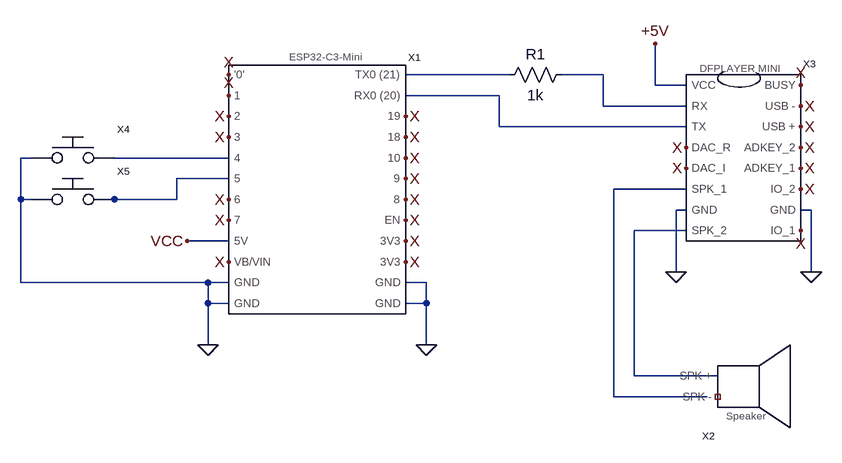
[diagram p0: schematic MP3_Player.asc]
MP3_Player.asc, the LTspice schematic file:
Version 4.1
SHEET 1 880 680
WIRE 176 0 16 0
WIRE 320 0 256 0
WIRE 400 16 400 -48
WIRE 448 16 400 16
WIRE 160 32 16 32
WIRE 320 48 320 0
WIRE 448 48 320 48
WIRE 160 80 160 32
WIRE 448 80 160 80
WIRE -560 128 -576 128
WIRE -256 128 -432 128
WIRE -256 160 -336 160
WIRE 448 176 336 176
WIRE -576 192 -576 128
WIRE -560 192 -576 192
WIRE -432 192 -448 192
WIRE -336 192 -336 160
WIRE -336 192 -432 192
WIRE 448 208 432 208
WIRE 640 208 624 208
WIRE 448 240 368 240
WIRE -256 256 -320 256
WIRE 432 304 432 208
WIRE 640 304 640 208
WIRE -576 320 -576 192
WIRE -288 320 -576 320
WIRE -256 320 -288 320
WIRE 48 320 16 320
WIRE -288 352 -288 320
WIRE -256 352 -288 352
WIRE 48 352 48 320
WIRE 48 352 16 352
WIRE -288 416 -288 352
WIRE 48 416 48 352
WIRE 368 464 368 240
WIRE 496 464 368 464
WIRE 336 496 336 176
WIRE 480 496 336 496
FLAG 400 -48 +5V
FLAG -320 256 VCC
FLAG -256 224 X
FLAG -256 288 X
FLAG 16 288 X
FLAG 16 256 X
FLAG 16 224 X
FLAG 16 192 X
FLAG 16 160 X
FLAG 16 128 X
FLAG 16 96 X
FLAG 16 64 X
FLAG -256 96 X
FLAG -256 64 X
FLAG -256 32 X
FLAG -256 0 X
FLAG 624 16 X
FLAG 624 48 X
FLAG 624 80 X
FLAG 624 112 X
FLAG 624 144 X
FLAG 624 176 X
FLAG 624 240 X
FLAG 448 144 X
FLAG 448 112 X
FLAG 48 416 0
FLAG -288 416 0
FLAG 432 304 0
FLAG 640 304 0
FLAG -256 192 X
SYMBOL symbols\\ESP32-C3-Mini -208 64 R0
SYMATTR InstName X1
SYMBOL symbols\\Speaker 448 464 R180
SYMATTR InstName X2
SYMBOL symbols\\DFPlayer_Mini 480 32 R0
SYMATTR InstName X3
SYMBOL res 160 16 R270
WINDOW 0 32 56 VTop 2
WINDOW 3 0 56 VBottom 2
SYMATTR InstName R1
SYMATTR Value 1k
SYMBOL symbols\\Push_Button -496 128 R0
SYMATTR InstName X4
SYMBOL symbols\\Push_Button -496 192 R0
SYMATTR InstName X5

The netlist it stands for:
* MP3_Player.asc
X§X1 X X X X N004 N005 X X VCC X 0 0 N001 N003 X X X X X X X X 0 0 ESP32-C3-Mini  ; pins '0' 1 2 3 4 5 6 7 5V VB/VIN GND GND TX0_(21) RX0_(20) 19 18 10 9 8 EN 3V3 3V3 GND GND
X§X2 NC_01 N007 Speaker  ; pins SPK_- SPK_+
X§X3 +5V N002 N003 X X N006 0 N007 X X X X X X 0 X DFPlayer_Mini  ; pins VCC RX TX DAC_R DAC_I SPK_1 GND SPK_2 BUSY USB_- USB_+ ADKEY_2 ADKEY_1 IO_2 GND IO_1
R1 N001 N002 1k
X§X4 0 N004 Push_Button
X§X5 0 N005 Push_Button
.backanno
.end